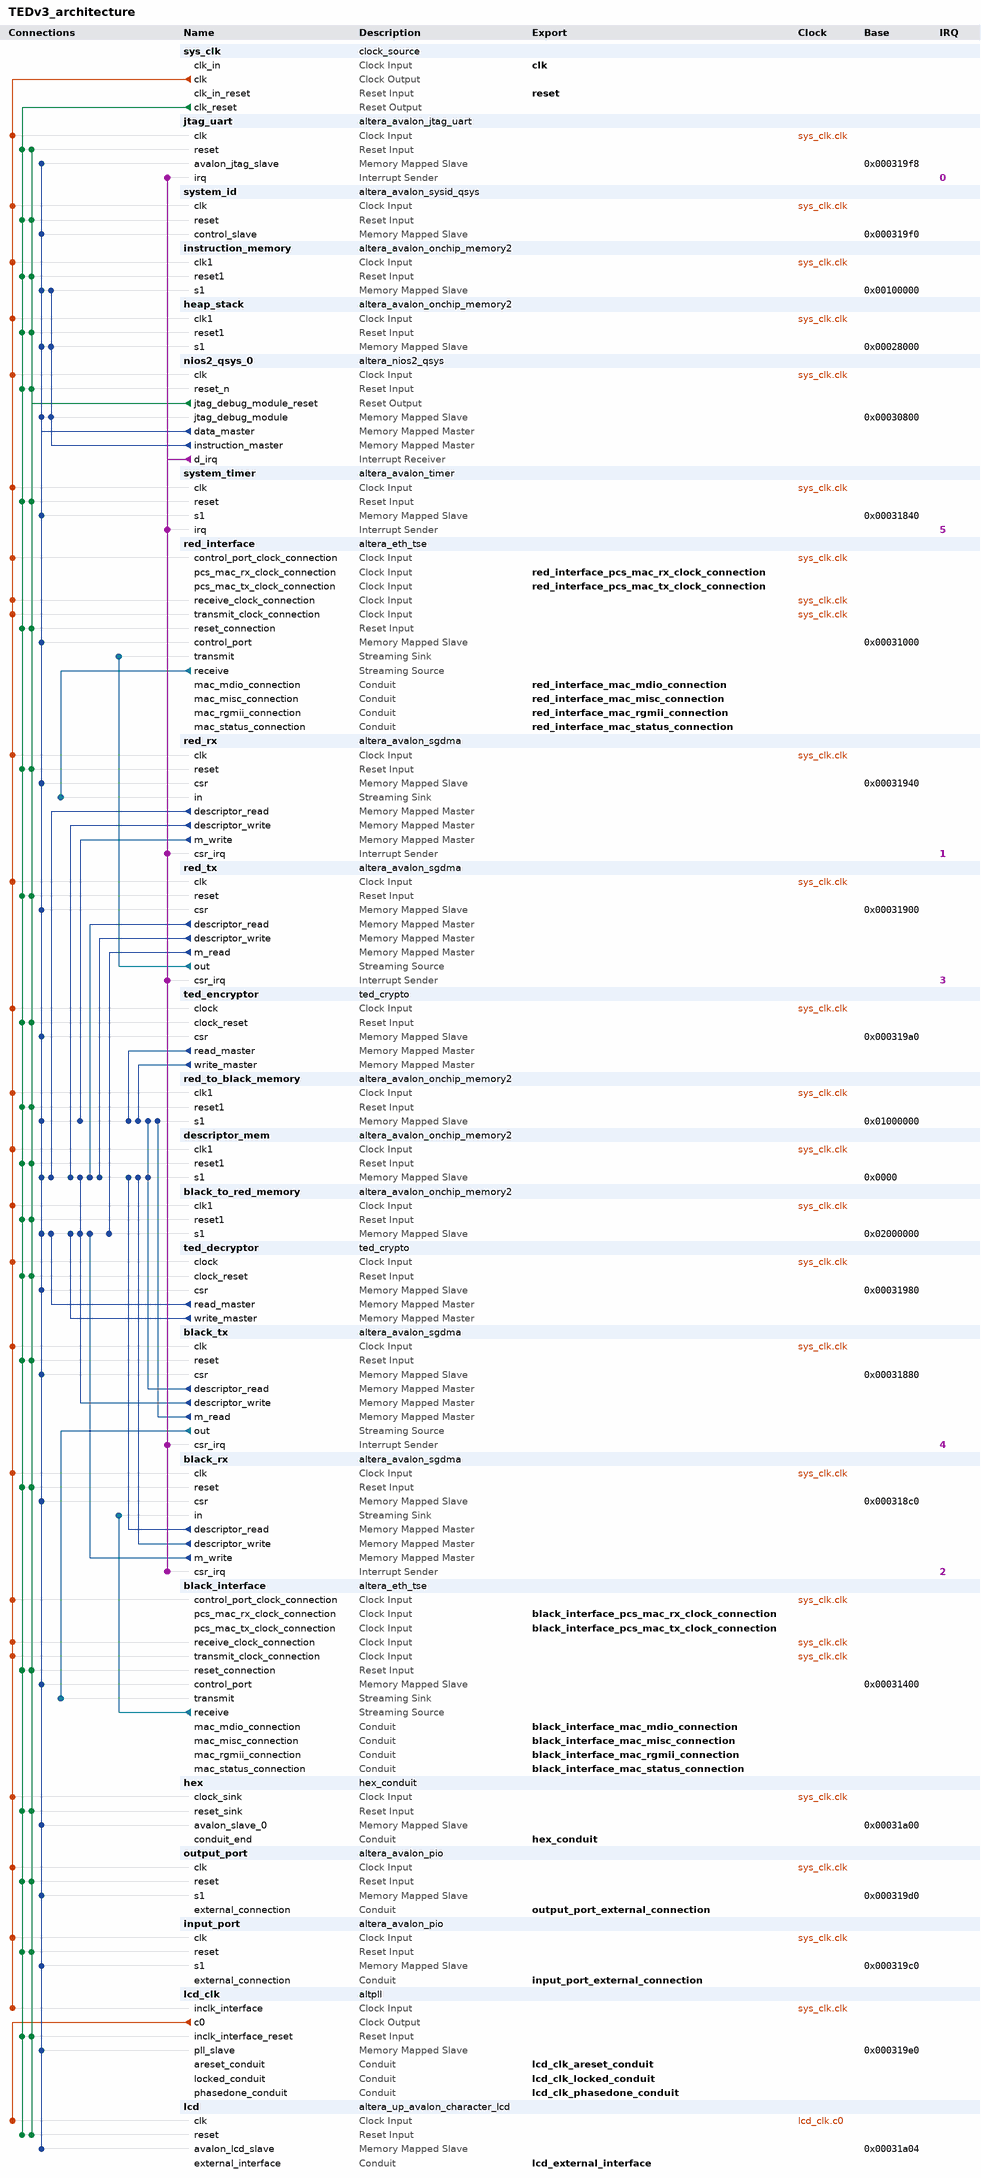
[diagram p0: system contents]
# Platform Designer (Qsys) system TEDv3_architecture, Cyclone IV E EP4CE115F29C8
# Parameters at their usual value, and those the tool derives, are not listed.
package require -exact qsys 14.1
create_system TEDv3_architecture
set_project_property DEVICE_FAMILY {Cyclone IV E}
set_project_property DEVICE EP4CE115F29C8

add_instance sys_clk clock_source 14.1
set_instance_parameter_value sys_clk clockFrequency 75000000

add_instance jtag_uart altera_avalon_jtag_uart 14.1
set_instance_parameter_value jtag_uart readBufferDepth 1024
set_instance_parameter_value jtag_uart simInteractiveOptions NO_INTERACTIVE_WINDOWS
set_instance_parameter_value jtag_uart writeBufferDepth 1024

add_instance system_id altera_avalon_sysid_qsys 14.1
set_instance_parameter_value system_id id 305419896

add_instance instruction_memory altera_avalon_onchip_memory2 14.1
set_instance_parameter_value instruction_memory dataWidth 32
set_instance_parameter_value instruction_memory dualPort false
set_instance_parameter_value instruction_memory initMemContent true
set_instance_parameter_value instruction_memory initializationFileName onchip_mem.hex
set_instance_parameter_value instruction_memory memorySize 200000

add_instance heap_stack altera_avalon_onchip_memory2 14.1
set_instance_parameter_value heap_stack dataWidth 32
set_instance_parameter_value heap_stack dualPort false
set_instance_parameter_value heap_stack initMemContent true
set_instance_parameter_value heap_stack initializationFileName onchip_mem.hex
set_instance_parameter_value heap_stack memorySize 25000

add_instance nios2_qsys_0 altera_nios2_qsys 14.1
set_instance_parameter_value nios2_qsys_0 breakSlave nios2_qsys_0.jtag_debug_module
set_instance_parameter_value nios2_qsys_0 exceptionSlave instruction_memory.s1
set_instance_parameter_value nios2_qsys_0 icache_size 4096
set_instance_parameter_value nios2_qsys_0 impl Tiny
set_instance_parameter_value nios2_qsys_0 mmu_TLBMissExcSlave None
set_instance_parameter_value nios2_qsys_0 resetSlave instruction_memory.s1
set_instance_parameter_value nios2_qsys_0 resetrequest_enabled true

add_instance system_timer altera_avalon_timer 14.1
set_instance_parameter_value system_timer counterSize 64
set_instance_parameter_value system_timer period 1
set_instance_parameter_value system_timer periodUnits MSEC

add_instance red_interface altera_eth_tse 14.1
set_instance_parameter_value red_interface core_variation MAC_ONLY
set_instance_parameter_value red_interface enable_hd_logic true
set_instance_parameter_value red_interface enable_mac_flow_ctrl true
set_instance_parameter_value red_interface enable_magic_detect false
set_instance_parameter_value red_interface enable_shift16 true
set_instance_parameter_value red_interface ifGMII RGMII
set_instance_parameter_value red_interface ing_addr 12
set_instance_parameter_value red_interface mdio_clk_div 30
set_instance_parameter_value red_interface stat_cnt_ena false
set_instance_parameter_value red_interface transceiver_type NONE

add_instance red_rx altera_avalon_sgdma 14.1
set_instance_parameter_value red_rx enableBurstTransfers false
set_instance_parameter_value red_rx enableUnalignedTransfers false
set_instance_parameter_value red_rx readBlockDataWidth 32
set_instance_parameter_value red_rx sinkErrorWidth 0
set_instance_parameter_value red_rx sourceErrorWidth 0
set_instance_parameter_value red_rx transferMode STREAM_TO_MEMORY
set_instance_parameter_value red_rx writeBurstcountWidth 4

add_instance red_tx altera_avalon_sgdma 14.1
set_instance_parameter_value red_tx enableBurstTransfers false
set_instance_parameter_value red_tx enableUnalignedTransfers false
set_instance_parameter_value red_tx readBlockDataWidth 32
set_instance_parameter_value red_tx sinkErrorWidth 0
set_instance_parameter_value red_tx sourceErrorWidth 0
set_instance_parameter_value red_tx transferMode MEMORY_TO_STREAM
set_instance_parameter_value red_tx writeBurstcountWidth 4

add_instance ted_encryptor ted_crypto 2.0

add_instance red_to_black_memory altera_avalon_onchip_memory2 14.1
set_instance_parameter_value red_to_black_memory dataWidth 32
set_instance_parameter_value red_to_black_memory dualPort false
set_instance_parameter_value red_to_black_memory initMemContent true
set_instance_parameter_value red_to_black_memory initializationFileName onchip_mem.hex
set_instance_parameter_value red_to_black_memory memorySize 48000

add_instance descriptor_mem altera_avalon_onchip_memory2 14.1
set_instance_parameter_value descriptor_mem dataWidth 32
set_instance_parameter_value descriptor_mem dualPort false
set_instance_parameter_value descriptor_mem initMemContent true
set_instance_parameter_value descriptor_mem initializationFileName onchip_mem.hex
set_instance_parameter_value descriptor_mem memorySize 16400

add_instance black_to_red_memory altera_avalon_onchip_memory2 14.1
set_instance_parameter_value black_to_red_memory dataWidth 32
set_instance_parameter_value black_to_red_memory dualPort false
set_instance_parameter_value black_to_red_memory initMemContent true
set_instance_parameter_value black_to_red_memory initializationFileName onchip_mem.hex
set_instance_parameter_value black_to_red_memory memorySize 48000

add_instance ted_decryptor ted_crypto 2.0

add_instance black_tx altera_avalon_sgdma 14.1
set_instance_parameter_value black_tx enableBurstTransfers false
set_instance_parameter_value black_tx enableUnalignedTransfers false
set_instance_parameter_value black_tx readBlockDataWidth 32
set_instance_parameter_value black_tx sinkErrorWidth 0
set_instance_parameter_value black_tx sourceErrorWidth 0
set_instance_parameter_value black_tx transferMode MEMORY_TO_STREAM
set_instance_parameter_value black_tx writeBurstcountWidth 4

add_instance black_rx altera_avalon_sgdma 14.1
set_instance_parameter_value black_rx enableBurstTransfers false
set_instance_parameter_value black_rx enableUnalignedTransfers false
set_instance_parameter_value black_rx readBlockDataWidth 32
set_instance_parameter_value black_rx sinkErrorWidth 0
set_instance_parameter_value black_rx sourceErrorWidth 0
set_instance_parameter_value black_rx transferMode STREAM_TO_MEMORY
set_instance_parameter_value black_rx writeBurstcountWidth 4

add_instance black_interface altera_eth_tse 14.1
set_instance_parameter_value black_interface core_variation MAC_ONLY
set_instance_parameter_value black_interface enable_hd_logic true
set_instance_parameter_value black_interface enable_mac_flow_ctrl true
set_instance_parameter_value black_interface enable_magic_detect false
set_instance_parameter_value black_interface enable_shift16 true
set_instance_parameter_value black_interface ifGMII RGMII
set_instance_parameter_value black_interface ing_addr 12
set_instance_parameter_value black_interface mdio_clk_div 30
set_instance_parameter_value black_interface stat_cnt_ena false
set_instance_parameter_value black_interface transceiver_type NONE

add_instance hex hex_conduit 1.0

add_instance output_port altera_avalon_pio 14.1
set_instance_parameter_value output_port direction Output
set_instance_parameter_value output_port width 32

add_instance input_port altera_avalon_pio 14.1
set_instance_parameter_value input_port direction Input
set_instance_parameter_value input_port width 32

add_instance lcd_clk altpll 14.1
set_instance_parameter_value lcd_clk CLK0_DIVIDE_BY 3
set_instance_parameter_value lcd_clk CLK0_MULTIPLY_BY 2
set_instance_parameter_value lcd_clk INCLK0_INPUT_FREQUENCY 13333
set_instance_parameter_value lcd_clk PORT_ARESET PORT_USED
set_instance_parameter_value lcd_clk PORT_LOCKED PORT_USED
set_instance_parameter_value lcd_clk PORT_clk1 PORT_UNUSED
set_instance_parameter_value lcd_clk PORT_clk2 PORT_UNUSED
set_instance_parameter_value lcd_clk PORT_clk3 PORT_UNUSED

add_instance lcd altera_up_avalon_character_lcd 14.0
set_instance_parameter_value lcd cursor None

# connections
add_connection lcd_clk.c0 lcd.clk clock
add_connection sys_clk.clk black_interface.control_port_clock_connection clock
add_connection sys_clk.clk black_interface.receive_clock_connection clock
add_connection sys_clk.clk black_interface.transmit_clock_connection clock
add_connection sys_clk.clk black_rx.clk clock
add_connection sys_clk.clk black_to_red_memory.clk1 clock
add_connection sys_clk.clk black_tx.clk clock
add_connection sys_clk.clk descriptor_mem.clk1 clock
add_connection sys_clk.clk heap_stack.clk1 clock
add_connection sys_clk.clk hex.clock_sink clock
add_connection sys_clk.clk input_port.clk clock
add_connection sys_clk.clk instruction_memory.clk1 clock
add_connection sys_clk.clk jtag_uart.clk clock
add_connection sys_clk.clk lcd_clk.inclk_interface clock
add_connection sys_clk.clk nios2_qsys_0.clk clock
add_connection sys_clk.clk output_port.clk clock
add_connection sys_clk.clk red_interface.control_port_clock_connection clock
add_connection sys_clk.clk red_interface.receive_clock_connection clock
add_connection sys_clk.clk red_interface.transmit_clock_connection clock
add_connection sys_clk.clk red_rx.clk clock
add_connection sys_clk.clk red_to_black_memory.clk1 clock
add_connection sys_clk.clk red_tx.clk clock
add_connection sys_clk.clk system_id.clk clock
add_connection sys_clk.clk system_timer.clk clock
add_connection sys_clk.clk ted_decryptor.clock clock
add_connection sys_clk.clk ted_encryptor.clock clock
add_connection nios2_qsys_0.jtag_debug_module_reset black_interface.reset_connection reset
add_connection nios2_qsys_0.jtag_debug_module_reset black_rx.reset reset
add_connection nios2_qsys_0.jtag_debug_module_reset black_to_red_memory.reset1 reset
add_connection nios2_qsys_0.jtag_debug_module_reset black_tx.reset reset
add_connection nios2_qsys_0.jtag_debug_module_reset descriptor_mem.reset1 reset
add_connection nios2_qsys_0.jtag_debug_module_reset heap_stack.reset1 reset
add_connection nios2_qsys_0.jtag_debug_module_reset hex.reset_sink reset
add_connection nios2_qsys_0.jtag_debug_module_reset input_port.reset reset
add_connection nios2_qsys_0.jtag_debug_module_reset instruction_memory.reset1 reset
add_connection nios2_qsys_0.jtag_debug_module_reset jtag_uart.reset reset
add_connection nios2_qsys_0.jtag_debug_module_reset lcd.reset reset
add_connection nios2_qsys_0.jtag_debug_module_reset lcd_clk.inclk_interface_reset reset
add_connection nios2_qsys_0.jtag_debug_module_reset nios2_qsys_0.reset_n reset
add_connection nios2_qsys_0.jtag_debug_module_reset output_port.reset reset
add_connection nios2_qsys_0.jtag_debug_module_reset red_interface.reset_connection reset
add_connection nios2_qsys_0.jtag_debug_module_reset red_rx.reset reset
add_connection nios2_qsys_0.jtag_debug_module_reset red_to_black_memory.reset1 reset
add_connection nios2_qsys_0.jtag_debug_module_reset red_tx.reset reset
add_connection nios2_qsys_0.jtag_debug_module_reset system_id.reset reset
add_connection nios2_qsys_0.jtag_debug_module_reset system_timer.reset reset
add_connection nios2_qsys_0.jtag_debug_module_reset ted_decryptor.clock_reset reset
add_connection nios2_qsys_0.jtag_debug_module_reset ted_encryptor.clock_reset reset
add_connection sys_clk.clk_reset black_interface.reset_connection reset
add_connection sys_clk.clk_reset black_rx.reset reset
add_connection sys_clk.clk_reset black_to_red_memory.reset1 reset
add_connection sys_clk.clk_reset black_tx.reset reset
add_connection sys_clk.clk_reset descriptor_mem.reset1 reset
add_connection sys_clk.clk_reset heap_stack.reset1 reset
add_connection sys_clk.clk_reset hex.reset_sink reset
add_connection sys_clk.clk_reset input_port.reset reset
add_connection sys_clk.clk_reset instruction_memory.reset1 reset
add_connection sys_clk.clk_reset jtag_uart.reset reset
add_connection sys_clk.clk_reset lcd.reset reset
add_connection sys_clk.clk_reset lcd_clk.inclk_interface_reset reset
add_connection sys_clk.clk_reset nios2_qsys_0.reset_n reset
add_connection sys_clk.clk_reset output_port.reset reset
add_connection sys_clk.clk_reset red_interface.reset_connection reset
add_connection sys_clk.clk_reset red_rx.reset reset
add_connection sys_clk.clk_reset red_to_black_memory.reset1 reset
add_connection sys_clk.clk_reset red_tx.reset reset
add_connection sys_clk.clk_reset system_id.reset reset
add_connection sys_clk.clk_reset system_timer.reset reset
add_connection sys_clk.clk_reset ted_decryptor.clock_reset reset
add_connection sys_clk.clk_reset ted_encryptor.clock_reset reset
add_connection black_rx.descriptor_read descriptor_mem.s1 avalon
set_connection_parameter_value black_rx.descriptor_read/descriptor_mem.s1 baseAddress 0x0000
add_connection black_rx.descriptor_write descriptor_mem.s1 avalon
set_connection_parameter_value black_rx.descriptor_write/descriptor_mem.s1 baseAddress 0x0000
add_connection black_rx.m_write black_to_red_memory.s1 avalon
set_connection_parameter_value black_rx.m_write/black_to_red_memory.s1 arbitrationPriority 4
set_connection_parameter_value black_rx.m_write/black_to_red_memory.s1 baseAddress 0x02000000
add_connection black_tx.descriptor_read descriptor_mem.s1 avalon
set_connection_parameter_value black_tx.descriptor_read/descriptor_mem.s1 baseAddress 0x0000
add_connection black_tx.descriptor_read red_to_black_memory.s1 avalon
set_connection_parameter_value black_tx.descriptor_read/red_to_black_memory.s1 baseAddress 0x01000000
add_connection black_tx.descriptor_write black_to_red_memory.s1 avalon
set_connection_parameter_value black_tx.descriptor_write/black_to_red_memory.s1 baseAddress 0x02000000
add_connection black_tx.descriptor_write descriptor_mem.s1 avalon
set_connection_parameter_value black_tx.descriptor_write/descriptor_mem.s1 baseAddress 0x0000
add_connection black_tx.m_read red_to_black_memory.s1 avalon
set_connection_parameter_value black_tx.m_read/red_to_black_memory.s1 arbitrationPriority 2
set_connection_parameter_value black_tx.m_read/red_to_black_memory.s1 baseAddress 0x01000000
add_connection nios2_qsys_0.data_master black_interface.control_port avalon
set_connection_parameter_value nios2_qsys_0.data_master/black_interface.control_port baseAddress 0x00031400
add_connection nios2_qsys_0.data_master black_rx.csr avalon
set_connection_parameter_value nios2_qsys_0.data_master/black_rx.csr baseAddress 0x000318c0
add_connection nios2_qsys_0.data_master black_to_red_memory.s1 avalon
set_connection_parameter_value nios2_qsys_0.data_master/black_to_red_memory.s1 baseAddress 0x02000000
add_connection nios2_qsys_0.data_master black_tx.csr avalon
set_connection_parameter_value nios2_qsys_0.data_master/black_tx.csr baseAddress 0x00031880
add_connection nios2_qsys_0.data_master descriptor_mem.s1 avalon
set_connection_parameter_value nios2_qsys_0.data_master/descriptor_mem.s1 baseAddress 0x0000
add_connection nios2_qsys_0.data_master heap_stack.s1 avalon
set_connection_parameter_value nios2_qsys_0.data_master/heap_stack.s1 baseAddress 0x00028000
add_connection nios2_qsys_0.data_master hex.avalon_slave_0 avalon
set_connection_parameter_value nios2_qsys_0.data_master/hex.avalon_slave_0 baseAddress 0x00031a00
add_connection nios2_qsys_0.data_master input_port.s1 avalon
set_connection_parameter_value nios2_qsys_0.data_master/input_port.s1 baseAddress 0x000319c0
add_connection nios2_qsys_0.data_master instruction_memory.s1 avalon
set_connection_parameter_value nios2_qsys_0.data_master/instruction_memory.s1 baseAddress 0x00100000
add_connection nios2_qsys_0.data_master jtag_uart.avalon_jtag_slave avalon
set_connection_parameter_value nios2_qsys_0.data_master/jtag_uart.avalon_jtag_slave baseAddress 0x000319f8
add_connection nios2_qsys_0.data_master lcd.avalon_lcd_slave avalon
set_connection_parameter_value nios2_qsys_0.data_master/lcd.avalon_lcd_slave baseAddress 0x00031a04
add_connection nios2_qsys_0.data_master lcd_clk.pll_slave avalon
set_connection_parameter_value nios2_qsys_0.data_master/lcd_clk.pll_slave baseAddress 0x000319e0
add_connection nios2_qsys_0.data_master nios2_qsys_0.jtag_debug_module avalon
set_connection_parameter_value nios2_qsys_0.data_master/nios2_qsys_0.jtag_debug_module baseAddress 0x00030800
add_connection nios2_qsys_0.data_master output_port.s1 avalon
set_connection_parameter_value nios2_qsys_0.data_master/output_port.s1 baseAddress 0x000319d0
add_connection nios2_qsys_0.data_master red_interface.control_port avalon
set_connection_parameter_value nios2_qsys_0.data_master/red_interface.control_port baseAddress 0x00031000
add_connection nios2_qsys_0.data_master red_rx.csr avalon
set_connection_parameter_value nios2_qsys_0.data_master/red_rx.csr baseAddress 0x00031940
add_connection nios2_qsys_0.data_master red_to_black_memory.s1 avalon
set_connection_parameter_value nios2_qsys_0.data_master/red_to_black_memory.s1 baseAddress 0x01000000
add_connection nios2_qsys_0.data_master red_tx.csr avalon
set_connection_parameter_value nios2_qsys_0.data_master/red_tx.csr baseAddress 0x00031900
add_connection nios2_qsys_0.data_master system_id.control_slave avalon
set_connection_parameter_value nios2_qsys_0.data_master/system_id.control_slave baseAddress 0x000319f0
add_connection nios2_qsys_0.data_master system_timer.s1 avalon
set_connection_parameter_value nios2_qsys_0.data_master/system_timer.s1 baseAddress 0x00031840
add_connection nios2_qsys_0.data_master ted_decryptor.csr avalon
set_connection_parameter_value nios2_qsys_0.data_master/ted_decryptor.csr baseAddress 0x00031980
add_connection nios2_qsys_0.data_master ted_encryptor.csr avalon
set_connection_parameter_value nios2_qsys_0.data_master/ted_encryptor.csr baseAddress 0x000319a0
add_connection nios2_qsys_0.instruction_master heap_stack.s1 avalon
set_connection_parameter_value nios2_qsys_0.instruction_master/heap_stack.s1 baseAddress 0x00028000
add_connection nios2_qsys_0.instruction_master instruction_memory.s1 avalon
set_connection_parameter_value nios2_qsys_0.instruction_master/instruction_memory.s1 baseAddress 0x00100000
add_connection nios2_qsys_0.instruction_master nios2_qsys_0.jtag_debug_module avalon
set_connection_parameter_value nios2_qsys_0.instruction_master/nios2_qsys_0.jtag_debug_module baseAddress 0x00030800
add_connection red_rx.descriptor_read descriptor_mem.s1 avalon
set_connection_parameter_value red_rx.descriptor_read/descriptor_mem.s1 baseAddress 0x0000
add_connection red_rx.descriptor_write descriptor_mem.s1 avalon
set_connection_parameter_value red_rx.descriptor_write/descriptor_mem.s1 baseAddress 0x0000
add_connection red_rx.m_write red_to_black_memory.s1 avalon
set_connection_parameter_value red_rx.m_write/red_to_black_memory.s1 arbitrationPriority 4
set_connection_parameter_value red_rx.m_write/red_to_black_memory.s1 baseAddress 0x01000000
add_connection red_tx.descriptor_read descriptor_mem.s1 avalon
set_connection_parameter_value red_tx.descriptor_read/descriptor_mem.s1 baseAddress 0x0000
add_connection red_tx.descriptor_write descriptor_mem.s1 avalon
set_connection_parameter_value red_tx.descriptor_write/descriptor_mem.s1 baseAddress 0x0000
add_connection red_tx.m_read black_to_red_memory.s1 avalon
set_connection_parameter_value red_tx.m_read/black_to_red_memory.s1 arbitrationPriority 2
set_connection_parameter_value red_tx.m_read/black_to_red_memory.s1 baseAddress 0x02000000
add_connection ted_decryptor.read_master black_to_red_memory.s1 avalon
set_connection_parameter_value ted_decryptor.read_master/black_to_red_memory.s1 arbitrationPriority 7
set_connection_parameter_value ted_decryptor.read_master/black_to_red_memory.s1 baseAddress 0x02000000
add_connection ted_decryptor.write_master black_to_red_memory.s1 avalon
set_connection_parameter_value ted_decryptor.write_master/black_to_red_memory.s1 arbitrationPriority 8
set_connection_parameter_value ted_decryptor.write_master/black_to_red_memory.s1 baseAddress 0x02000000
add_connection ted_encryptor.read_master red_to_black_memory.s1 avalon
set_connection_parameter_value ted_encryptor.read_master/red_to_black_memory.s1 arbitrationPriority 7
set_connection_parameter_value ted_encryptor.read_master/red_to_black_memory.s1 baseAddress 0x01000000
add_connection ted_encryptor.write_master red_to_black_memory.s1 avalon
set_connection_parameter_value ted_encryptor.write_master/red_to_black_memory.s1 arbitrationPriority 8
set_connection_parameter_value ted_encryptor.write_master/red_to_black_memory.s1 baseAddress 0x01000000
add_connection black_interface.receive black_rx.in avalon_streaming
add_connection black_tx.out black_interface.transmit avalon_streaming
add_connection red_interface.receive red_rx.in avalon_streaming
add_connection red_tx.out red_interface.transmit avalon_streaming
add_connection nios2_qsys_0.d_irq black_rx.csr_irq interrupt
set_connection_parameter_value nios2_qsys_0.d_irq/black_rx.csr_irq irqNumber 2
add_connection nios2_qsys_0.d_irq black_tx.csr_irq interrupt
set_connection_parameter_value nios2_qsys_0.d_irq/black_tx.csr_irq irqNumber 4
add_connection nios2_qsys_0.d_irq jtag_uart.irq interrupt
set_connection_parameter_value nios2_qsys_0.d_irq/jtag_uart.irq irqNumber 0
add_connection nios2_qsys_0.d_irq red_rx.csr_irq interrupt
set_connection_parameter_value nios2_qsys_0.d_irq/red_rx.csr_irq irqNumber 1
add_connection nios2_qsys_0.d_irq red_tx.csr_irq interrupt
set_connection_parameter_value nios2_qsys_0.d_irq/red_tx.csr_irq irqNumber 3
add_connection nios2_qsys_0.d_irq system_timer.irq interrupt
set_connection_parameter_value nios2_qsys_0.d_irq/system_timer.irq irqNumber 5

# exported interfaces
add_interface black_interface_mac_mdio_connection conduit end
set_interface_property black_interface_mac_mdio_connection EXPORT_OF black_interface.mac_mdio_connection
add_interface black_interface_mac_misc_connection conduit end
set_interface_property black_interface_mac_misc_connection EXPORT_OF black_interface.mac_misc_connection
add_interface black_interface_mac_rgmii_connection conduit end
set_interface_property black_interface_mac_rgmii_connection EXPORT_OF black_interface.mac_rgmii_connection
add_interface black_interface_mac_status_connection conduit end
set_interface_property black_interface_mac_status_connection EXPORT_OF black_interface.mac_status_connection
add_interface black_interface_pcs_mac_rx_clock_connection clock sink
set_interface_property black_interface_pcs_mac_rx_clock_connection EXPORT_OF black_interface.pcs_mac_rx_clock_connection
add_interface black_interface_pcs_mac_tx_clock_connection clock sink
set_interface_property black_interface_pcs_mac_tx_clock_connection EXPORT_OF black_interface.pcs_mac_tx_clock_connection
add_interface clk clock sink
set_interface_property clk EXPORT_OF sys_clk.clk_in
add_interface hex_conduit conduit end
set_interface_property hex_conduit EXPORT_OF hex.conduit_end
add_interface input_port_external_connection conduit end
set_interface_property input_port_external_connection EXPORT_OF input_port.external_connection
add_interface lcd_clk_areset_conduit conduit end
set_interface_property lcd_clk_areset_conduit EXPORT_OF lcd_clk.areset_conduit
add_interface lcd_clk_locked_conduit conduit end
set_interface_property lcd_clk_locked_conduit EXPORT_OF lcd_clk.locked_conduit
add_interface lcd_clk_phasedone_conduit conduit end
set_interface_property lcd_clk_phasedone_conduit EXPORT_OF lcd_clk.phasedone_conduit
add_interface lcd_external_interface conduit end
set_interface_property lcd_external_interface EXPORT_OF lcd.external_interface
add_interface output_port_external_connection conduit end
set_interface_property output_port_external_connection EXPORT_OF output_port.external_connection
add_interface red_interface_mac_mdio_connection conduit end
set_interface_property red_interface_mac_mdio_connection EXPORT_OF red_interface.mac_mdio_connection
add_interface red_interface_mac_misc_connection conduit end
set_interface_property red_interface_mac_misc_connection EXPORT_OF red_interface.mac_misc_connection
add_interface red_interface_mac_rgmii_connection conduit end
set_interface_property red_interface_mac_rgmii_connection EXPORT_OF red_interface.mac_rgmii_connection
add_interface red_interface_mac_status_connection conduit end
set_interface_property red_interface_mac_status_connection EXPORT_OF red_interface.mac_status_connection
add_interface red_interface_pcs_mac_rx_clock_connection clock sink
set_interface_property red_interface_pcs_mac_rx_clock_connection EXPORT_OF red_interface.pcs_mac_rx_clock_connection
add_interface red_interface_pcs_mac_tx_clock_connection clock sink
set_interface_property red_interface_pcs_mac_tx_clock_connection EXPORT_OF red_interface.pcs_mac_tx_clock_connection
add_interface reset reset sink
set_interface_property reset EXPORT_OF sys_clk.clk_in_reset

set_interconnect_requirement {$system} qsys_mm.clockCrossingAdapter HANDSHAKE
set_interconnect_requirement {$system} qsys_mm.insertDefaultSlave FALSE
set_interconnect_requirement {$system} qsys_mm.maxAdditionalLatency 1

save_system TEDv3_architecture.qsys
